# Altium schematic sheet LM393.schdoc
size 54 x 38 mm
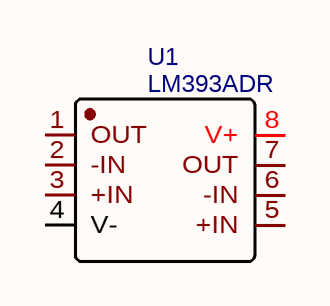
[diagram p0: LM393.schdoc]

## Parts
U1  LM393ADR  [SOIC-8_L5.0-W4.0-P1.27-LS6.0-BL]

## Nets

Not connected (* = marked no-connect by the designer): U1 1(OUT) 2(-IN) 3(+IN) 4(V-) 5(+IN) 6(-IN) 7(OUT) 8(V+)

## Library data of the parts
U1 = LM393ADR: BOM_Manufacturer: TI; SMT Type: Extend; BOM_Supplier: LCSC; BOM_Manufacturer Part: LM393ADR; image: //image.lceda.cn/szlcsc/C30394.jpg; BOM_Supplier Part: C30394; BOM_JLCPCB SMD: Yes; spicePre: U; spiceSymbolName: LM393ADR